# Altium schematic sheet RPI_CM5_PINOUT.SchDoc
size C; SheetNumber: 4; SheetTotal: 17
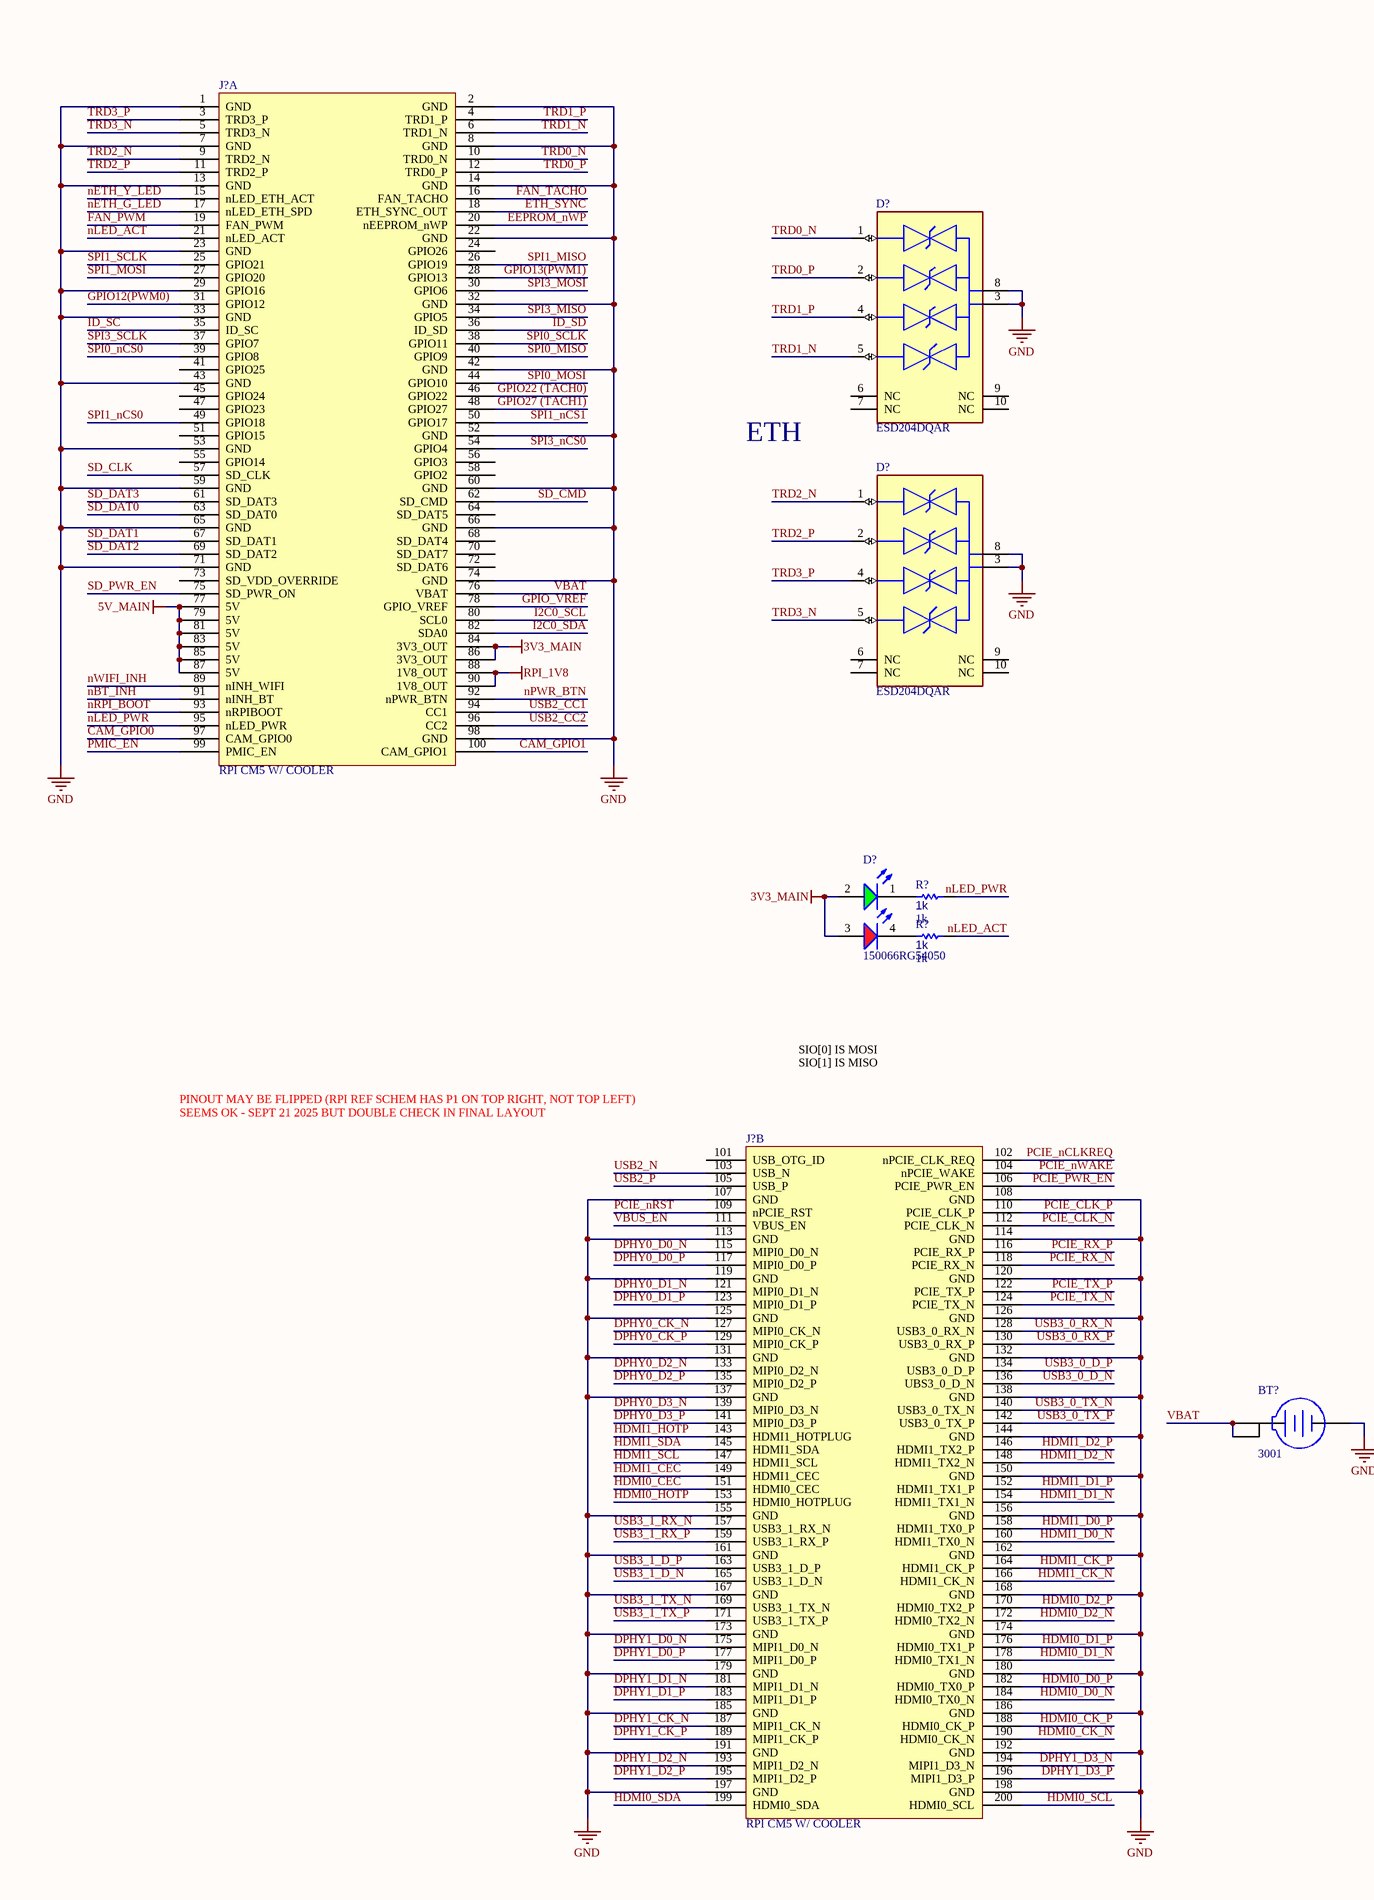
[diagram p0: RPI_CM5_PINOUT.SchDoc, left]
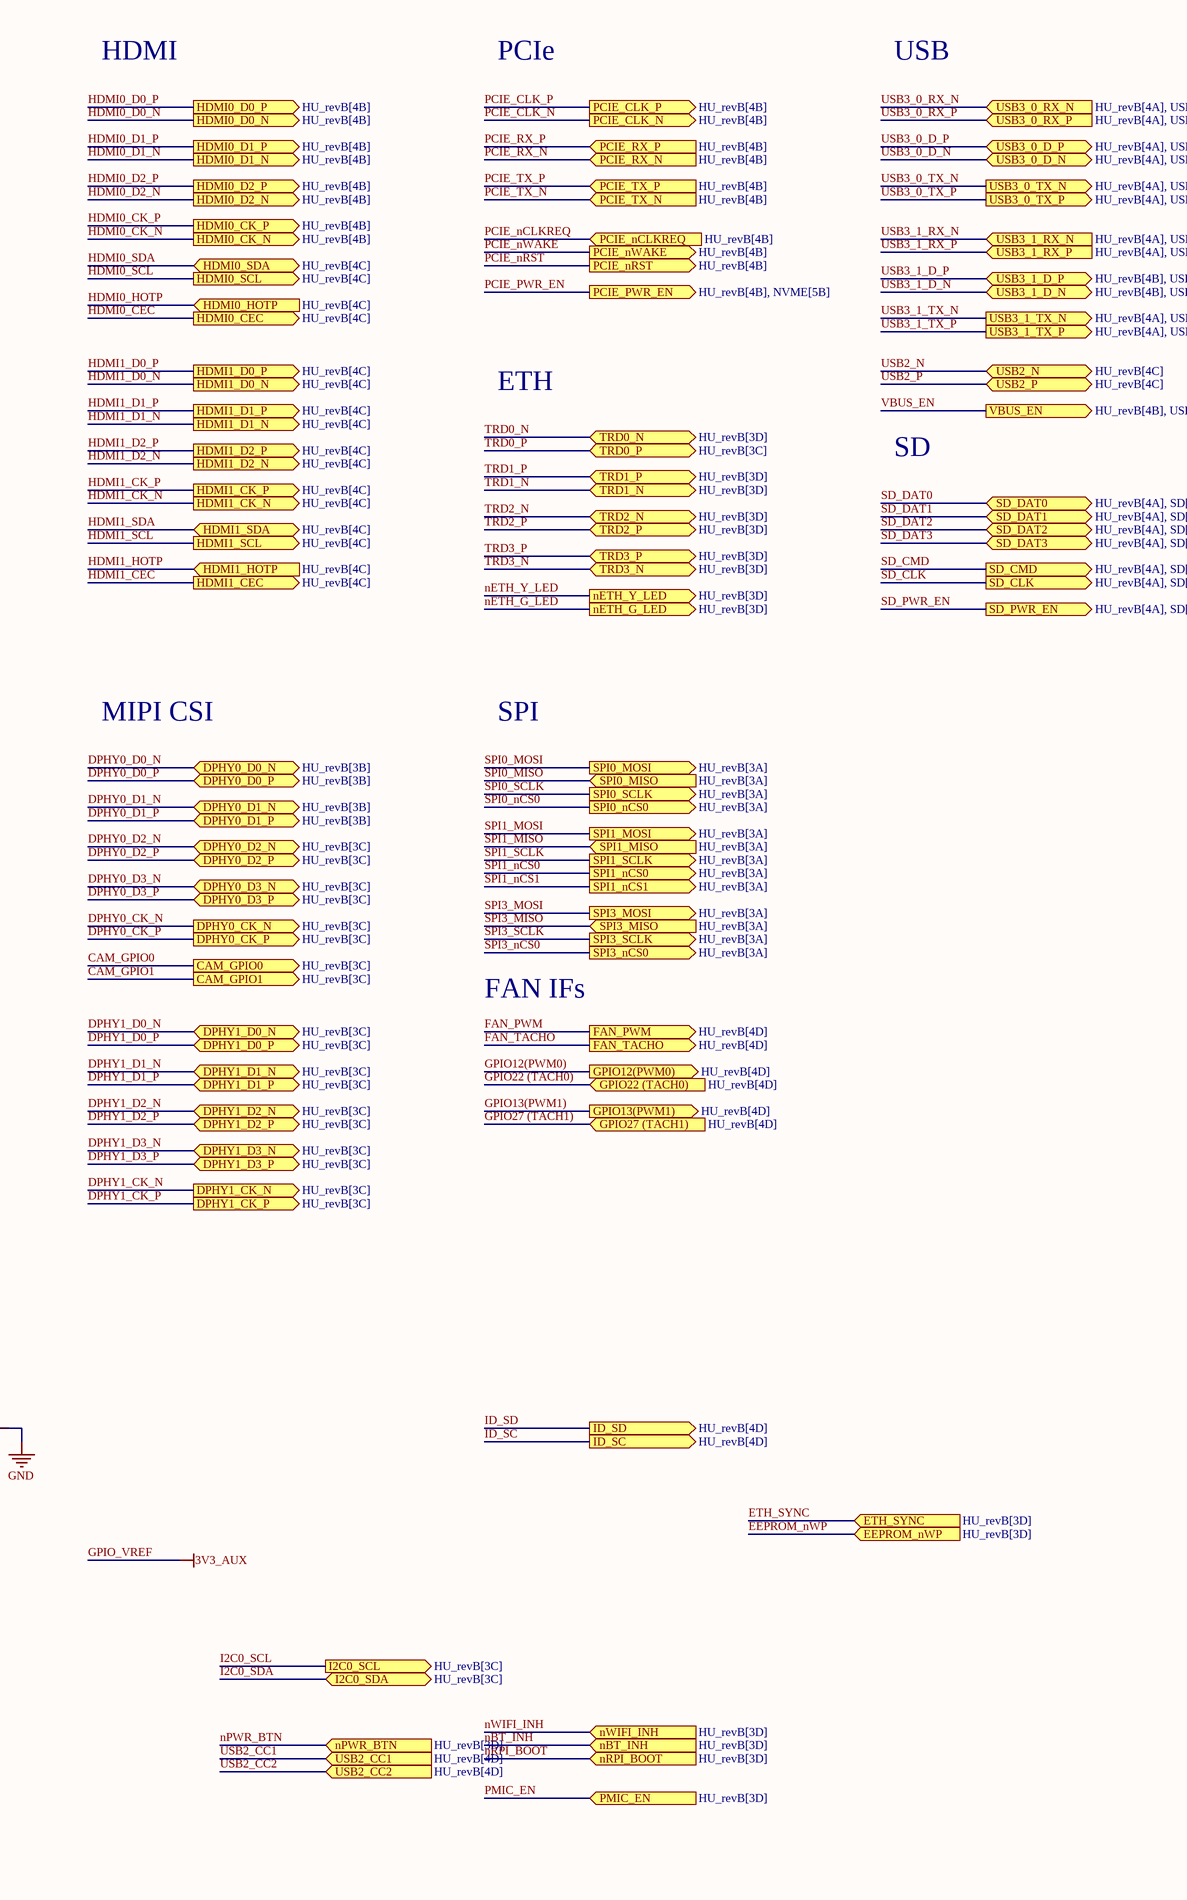
[diagram p1: RPI_CM5_PINOUT.SchDoc, right]

## Parts
(Parts that share a designator on the sheet are numbered #1, #2 ... from top to bottom, then left to right.)
BT?  3001  [KSTN-3001_V]
D?#1  ESD204DQAR  [FP-DQA0010A-MFG]
D?#2  ESD204DQAR  [FP-DQA0010A-MFG]
D?#3  150066RG54050  [WL-SBCD_0606]
J?#1  RPI CM5 W/ COOLER  [RPI CM5 W_ COOLER-Footprint-1]  (part A of 2)
J?#2  RPI CM5 W/ COOLER  [RPI CM5 W_ COOLER-Footprint-1]  (part B of 2)
R?#1  1k  [R0603B]
R?#2  1k  [R0603B]

## Ports
CAM_GPIO0 (out, see HU_revB[3C]), CAM_GPIO1 (out, see HU_revB[3C]), DPHY0_CK_N (out, see HU_revB[3C]), DPHY0_CK_P (out, see HU_revB[3C]), DPHY0_D0_N (bidir, see HU_revB[3B]), DPHY0_D0_P (bidir, see HU_revB[3B]), DPHY0_D1_N (bidir, see HU_revB[3B]), DPHY0_D1_P (bidir, see HU_revB[3B]), DPHY0_D2_N (bidir, see HU_revB[3C]), DPHY0_D2_P (bidir, see HU_revB[3C]), DPHY0_D3_N (bidir, see HU_revB[3C]), DPHY0_D3_P (bidir, see HU_revB[3C]), DPHY1_CK_N (out, see HU_revB[3C]), DPHY1_CK_P (out, see HU_revB[3C]), DPHY1_D0_N (bidir, see HU_revB[3C]), DPHY1_D0_P (bidir, see HU_revB[3C]), DPHY1_D1_N (bidir, see HU_revB[3C]), DPHY1_D1_P (bidir, see HU_revB[3C]), DPHY1_D2_N (bidir, see HU_revB[3C]), DPHY1_D2_P (bidir, see HU_revB[3C]), DPHY1_D3_N (bidir, see HU_revB[3C]), DPHY1_D3_P (bidir, see HU_revB[3C]), EEPROM_nWP (in, see HU_revB[3D]), ETH_SYNC (in, see HU_revB[3D]), FAN_PWM (out, see HU_revB[4D]), FAN_TACHO (out, see HU_revB[4D]), GPIO12(PWM0) (out, see HU_revB[4D]), GPIO13(PWM1) (out, see HU_revB[4D]), GPIO22 (TACH0) (in, see HU_revB[4D]), GPIO27 (TACH1) (in, see HU_revB[4D]), HDMI0_CEC (out, see HU_revB[4C]), HDMI0_CK_N (out, see HU_revB[4B]), HDMI0_CK_P (out, see HU_revB[4B]), HDMI0_D0_N (out, see HU_revB[4B]), HDMI0_D0_P (out, see HU_revB[4B]), HDMI0_D1_N (out, see HU_revB[4B]), HDMI0_D1_P (out, see HU_revB[4B]), HDMI0_D2_N (out, see HU_revB[4B]), HDMI0_D2_P (out, see HU_revB[4B]), HDMI0_HOTP (in, see HU_revB[4C]), HDMI0_SCL (out, see HU_revB[4C]), HDMI0_SDA (bidir, see HU_revB[4C]), HDMI1_CEC (out, see HU_revB[4C]), HDMI1_CK_N (out, see HU_revB[4C]), HDMI1_CK_P (out, see HU_revB[4C]), HDMI1_D0_N (out, see HU_revB[4C]), HDMI1_D0_P (out, see HU_revB[4C]), HDMI1_D1_N (out, see HU_revB[4C]), HDMI1_D1_P (out, see HU_revB[4C]), HDMI1_D2_N (out, see HU_revB[4C]), HDMI1_D2_P (out, see HU_revB[4C]), HDMI1_HOTP (in, see HU_revB[4C]), HDMI1_SCL (out, see HU_revB[4C]), HDMI1_SDA (bidir, see HU_revB[4C]), I2C0_SCL (out, see HU_revB[3C]), I2C0_SDA (bidir, see HU_revB[3C]), ID_SC (out, see HU_revB[4D]), ID_SD (out, see HU_revB[4D]), nBT_INH (in, see HU_revB[3D]), nETH_G_LED (out, see HU_revB[3D]), nETH_Y_LED (out, see HU_revB[3D]), nPWR_BTN (in, see HU_revB[3D]), nRPI_BOOT (in, see HU_revB[3D]), nWIFI_INH (in, see HU_revB[3D]), PCIE_CLK_N (out, see HU_revB[4B]), PCIE_CLK_P (out, see HU_revB[4B]), PCIE_nCLKREQ (in, see HU_revB[4B]), PCIE_nRST (out, see HU_revB[4B]), PCIE_nWAKE (out, see HU_revB[4B]), PCIE_PWR_EN (out, see HU_revB[4B], NVME[5B]), PCIE_RX_N (in, see HU_revB[4B]), PCIE_RX_P (in, see HU_revB[4B]), PCIE_TX_N (in, see HU_revB[4B]), PCIE_TX_P (in, see HU_revB[4B]), PMIC_EN (in, see HU_revB[3D]), SD_CLK (out, see HU_revB[4A], SD[3B]), SD_CMD (out, see HU_revB[4A], SD[3B]), SD_DAT0 (bidir, see HU_revB[4A], SD[3B]), SD_DAT1 (bidir, see HU_revB[4A], SD[3B]), SD_DAT2 (bidir, see HU_revB[4A], SD[3B]), SD_DAT3 (bidir, see HU_revB[4A], SD[3B]), SD_PWR_EN (out, see HU_revB[4A], SD[1B]), SPI0_MISO (in, see HU_revB[3A]), SPI0_MOSI (out, see HU_revB[3A]), SPI0_nCS0 (out, see HU_revB[3A]), SPI0_SCLK (out, see HU_revB[3A]), SPI1_MISO (in, see HU_revB[3A]), SPI1_MOSI (out, see HU_revB[3A]), SPI1_nCS0 (out, see HU_revB[3A]), SPI1_nCS1 (out, see HU_revB[3A]), SPI1_SCLK (out, see HU_revB[3A]), SPI3_MISO (in, see HU_revB[3A]), SPI3_MOSI (out, see HU_revB[3A]), SPI3_nCS0 (out, see HU_revB[3A]), SPI3_SCLK (out, see HU_revB[3A]), TRD0_N (bidir, see HU_revB[3D]), TRD0_P (bidir, see HU_revB[3C]), TRD1_N (bidir, see HU_revB[3D]), TRD1_P (bidir, see HU_revB[3D]), TRD2_N (bidir, see HU_revB[3D]), TRD2_P (bidir, see HU_revB[3D]), TRD3_N (bidir, see HU_revB[3D]), TRD3_P (bidir, see HU_revB[3D]), USB2_CC1 (in, see HU_revB[4D]), USB2_CC2 (in, see HU_revB[4D]), USB2_N (bidir, see HU_revB[4C]), USB2_P (bidir, see HU_revB[4C]), USB3_0_D_N (bidir, see HU_revB[4A], USB[3A]), USB3_0_D_P (bidir, see HU_revB[4A], USB[3A]), USB3_0_RX_N (in, see HU_revB[4A], USB[3B]), USB3_0_RX_P (in, see HU_revB[4A], USB[3B]), USB3_0_TX_N (out, see HU_revB[4A], USB[3B]), USB3_0_TX_P (out, see HU_revB[4A], USB[3B]), USB3_1_D_N (bidir, see HU_revB[4B], USB[3B]), USB3_1_D_P (bidir, see HU_revB[4B], USB[3C]), USB3_1_RX_N (in, see HU_revB[4A], USB[3C]), USB3_1_RX_P (in, see HU_revB[4A], USB[3C]), USB3_1_TX_N (out, see HU_revB[4A], USB[3C]), USB3_1_TX_P (out, see HU_revB[4A], USB[3C]), VBUS_EN (out, see HU_revB[4B], USB[1B])

## Nets
3V3_MAIN: D?#3.2(A) D?#3.3(A) J?#1.84(3V3_OUT) J?#1.86(3V3_OUT)
5V_MAIN: J?#1.77(5V) J?#1.79(5V) J?#1.81(5V) J?#1.83(5V) J?#1.85(5V) J?#1.87(5V)
GND: BT?.3(-) D?#1.3(GND) D?#1.8(GND) D?#2.3(GND) D?#2.8(GND) J?#1.1(GND) J?#1.2(GND) J?#1.7(GND) J?#1.8(GND) J?#1.13(GND) J?#1.14(GND) J?#1.22(GND) J?#1.23(GND) J?#1.29(GPIO16) J?#1.32(GND) J?#1.33(GND) J?#1.42(GND) J?#1.43(GND) J?#1.52(GND) J?#1.53(GND) J?#1.59(GND) J?#1.60(GND) J?#1.65(GND) J?#1.66(GND) J?#1.71(GND) J?#1.74(GND) J?#1.98(GND) J?#2.107(GND) J?#2.108(GND) J?#2.113(GND) J?#2.114(GND) J?#2.119(GND) J?#2.120(GND) J?#2.125(GND) J?#2.126(GND) J?#2.131(GND) J?#2.132(GND) J?#2.137(GND) J?#2.138(GND) J?#2.144(GND) J?#2.150(GND) J?#2.155(GND) J?#2.156(GND) J?#2.161(GND) J?#2.162(GND) J?#2.167(GND) J?#2.168(GND) J?#2.173(GND) J?#2.174(GND) J?#2.179(GND) J?#2.180(GND) J?#2.185(GND) J?#2.186(GND) J?#2.191(GND) J?#2.192(GND) J?#2.197(GND) J?#2.198(GND)
GPIO_VREF: J?#1.78(GPIO_VREF)  [also labelled 3V3_AUX]
RPI_1V8: J?#1.88(1V8_OUT) J?#1.90(1V8_OUT)
CAM_GPIO0: J?#1.97(CAM_GPIO0) ; port CAM_GPIO0
CAM_GPIO1: J?#1.100(CAM_GPIO1) ; port CAM_GPIO1
DPHY0_CK_N: J?#2.127(MIPI0_CK_N) ; port DPHY0_CK_N
DPHY0_CK_P: J?#2.129(MIPI0_CK_P) ; port DPHY0_CK_P
DPHY0_D0_N: J?#2.115(MIPI0_D0_N) ; port DPHY0_D0_N
DPHY0_D0_P: J?#2.117(MIPI0_D0_P) ; port DPHY0_D0_P
DPHY0_D1_N: J?#2.121(MIPI0_D1_N) ; port DPHY0_D1_N
DPHY0_D1_P: J?#2.123(MIPI0_D1_P) ; port DPHY0_D1_P
DPHY0_D2_N: J?#2.133(MIPI0_D2_N) ; port DPHY0_D2_N
DPHY0_D2_P: J?#2.135(MIPI0_D2_P) ; port DPHY0_D2_P
DPHY0_D3_N: J?#2.139(MIPI0_D3_N) ; port DPHY0_D3_N
DPHY0_D3_P: J?#2.141(MIPI0_D3_P) ; port DPHY0_D3_P
DPHY1_CK_N: J?#2.187(MIPI1_CK_N) ; port DPHY1_CK_N
DPHY1_CK_P: J?#2.189(MIPI1_CK_P) ; port DPHY1_CK_P
DPHY1_D0_N: J?#2.175(MIPI1_D0_N) ; port DPHY1_D0_N
DPHY1_D0_P: J?#2.177(MIPI1_D0_P) ; port DPHY1_D0_P
DPHY1_D1_N: J?#2.181(MIPI1_D1_N) ; port DPHY1_D1_N
DPHY1_D1_P: J?#2.183(MIPI1_D1_P) ; port DPHY1_D1_P
DPHY1_D2_N: J?#2.193(MIPI1_D2_N) ; port DPHY1_D2_N
DPHY1_D2_P: J?#2.195(MIPI1_D2_P) ; port DPHY1_D2_P
DPHY1_D3_N: J?#2.194(MIPI1_D3_N) ; port DPHY1_D3_N
DPHY1_D3_P: J?#2.196(MIPI1_D3_P) ; port DPHY1_D3_P
EEPROM_nWP: J?#1.20(nEEPROM_nWP) ; port EEPROM_nWP
ETH_SYNC: J?#1.18(ETH_SYNC_OUT) ; port ETH_SYNC
FAN_PWM: J?#1.19(FAN_PWM) ; port FAN_PWM
FAN_TACHO: J?#1.16(FAN_TACHO) ; port FAN_TACHO
GPIO12(PWM0): J?#1.31(GPIO12) ; port GPIO12(PWM0)
GPIO13(PWM1): J?#1.28(GPIO13) ; port GPIO13(PWM1)
GPIO22 (TACH0): J?#1.46(GPIO22) ; port GPIO22 (TACH0)
GPIO27 (TACH1): J?#1.48(GPIO27) ; port GPIO27 (TACH1)
HDMI0_CEC: J?#2.151(HDMI0_CEC) ; port HDMI0_CEC
HDMI0_CK_N: J?#2.190(HDMI0_CK_N) ; port HDMI0_CK_N
HDMI0_CK_P: J?#2.188(HDMI0_CK_P) ; port HDMI0_CK_P
HDMI0_D0_N: J?#2.184(HDMI0_TX0_N) ; port HDMI0_D0_N
HDMI0_D0_P: J?#2.182(HDMI0_TX0_P) ; port HDMI0_D0_P
HDMI0_D1_N: J?#2.178(HDMI0_TX1_N) ; port HDMI0_D1_N
HDMI0_D1_P: J?#2.176(HDMI0_TX1_P) ; port HDMI0_D1_P
HDMI0_D2_N: J?#2.172(HDMI0_TX2_N) ; port HDMI0_D2_N
HDMI0_D2_P: J?#2.170(HDMI0_TX2_P) ; port HDMI0_D2_P
HDMI0_HOTP: J?#2.153(HDMI0_HOTPLUG) ; port HDMI0_HOTP
HDMI0_SCL: J?#2.200(HDMI0_SCL) ; port HDMI0_SCL
HDMI0_SDA: J?#2.199(HDMI0_SDA) ; port HDMI0_SDA
HDMI1_CEC: J?#2.149(HDMI1_CEC) ; port HDMI1_CEC
HDMI1_CK_N: J?#2.166(HDMI1_CK_N) ; port HDMI1_CK_N
HDMI1_CK_P: J?#2.164(HDMI1_CK_P) ; port HDMI1_CK_P
HDMI1_D0_N: J?#2.160(HDMI1_TX0_N) ; port HDMI1_D0_N
HDMI1_D0_P: J?#2.158(HDMI1_TX0_P) ; port HDMI1_D0_P
HDMI1_D1_N: J?#2.154(HDMI1_TX1_N) ; port HDMI1_D1_N
HDMI1_D1_P: J?#2.152(HDMI1_TX1_P) ; port HDMI1_D1_P
HDMI1_D2_N: J?#2.148(HDMI1_TX2_N) ; port HDMI1_D2_N
HDMI1_D2_P: J?#2.146(HDMI1_TX2_P) ; port HDMI1_D2_P
HDMI1_HOTP: J?#2.143(HDMI1_HOTPLUG) ; port HDMI1_HOTP
HDMI1_SCL: J?#2.147(HDMI1_SCL) ; port HDMI1_SCL
HDMI1_SDA: J?#2.145(HDMI1_SDA) ; port HDMI1_SDA
I2C0_SCL: J?#1.80(SCL0) ; port I2C0_SCL
I2C0_SDA: J?#1.82(SDA0) ; port I2C0_SDA
ID_SC: J?#1.35(ID_SC) ; port ID_SC
ID_SD: J?#1.36(ID_SD) ; port ID_SD
nBT_INH: J?#1.91(nINH_BT) ; port nBT_INH
nETH_G_LED: J?#1.17(nLED_ETH_SPD) ; port nETH_G_LED
nETH_Y_LED: J?#1.15(nLED_ETH_ACT) ; port nETH_Y_LED
nLED_ACT: J?#1.21(nLED_ACT) R?#2.2
nLED_PWR: J?#1.95(nLED_PWR) R?#1.2
nPWR_BTN: J?#1.92(nPWR_BTN) ; port nPWR_BTN
nRPI_BOOT: J?#1.93(nRPIBOOT) ; port nRPI_BOOT
nWIFI_INH: J?#1.89(nINH_WIFI) ; port nWIFI_INH
PCIE_CLK_N: J?#2.112(PCIE_CLK_N) ; port PCIE_CLK_N
PCIE_CLK_P: J?#2.110(PCIE_CLK_P) ; port PCIE_CLK_P
PCIE_nCLKREQ: J?#2.102(nPCIE_CLK_REQ) ; port PCIE_nCLKREQ
PCIE_nRST: J?#2.109(nPCIE_RST) ; port PCIE_nRST
PCIE_nWAKE: J?#2.104(nPCIE_WAKE) ; port PCIE_nWAKE
PCIE_PWR_EN: J?#2.106(PCIE_PWR_EN) ; port PCIE_PWR_EN
PCIE_RX_N: J?#2.118(PCIE_RX_N) ; port PCIE_RX_N
PCIE_RX_P: J?#2.116(PCIE_RX_P) ; port PCIE_RX_P
PCIE_TX_N: J?#2.124(PCIE_TX_N) ; port PCIE_TX_N
PCIE_TX_P: J?#2.122(PCIE_TX_P) ; port PCIE_TX_P
PMIC_EN: J?#1.99(PMIC_EN) ; port PMIC_EN
SD_CLK: J?#1.57(SD_CLK) ; port SD_CLK
SD_CMD: J?#1.62(SD_CMD) ; port SD_CMD
SD_DAT0: J?#1.63(SD_DAT0) ; port SD_DAT0
SD_DAT1: J?#1.67(SD_DAT1) ; port SD_DAT1
SD_DAT2: J?#1.69(SD_DAT2) ; port SD_DAT2
SD_DAT3: J?#1.61(SD_DAT3) ; port SD_DAT3
SD_PWR_EN: J?#1.75(SD_PWR_ON) ; port SD_PWR_EN
SPI0_MISO: J?#1.40(GPIO9) ; port SPI0_MISO
SPI0_MOSI: J?#1.44(GPIO10) ; port SPI0_MOSI
SPI0_nCS0: J?#1.39(GPIO8) ; port SPI0_nCS0
SPI0_SCLK: J?#1.38(GPIO11) ; port SPI0_SCLK
SPI1_MISO: J?#1.26(GPIO19) ; port SPI1_MISO
SPI1_MOSI: J?#1.27(GPIO20) ; port SPI1_MOSI
SPI1_nCS0: J?#1.49(GPIO18) ; port SPI1_nCS0
SPI1_nCS1: J?#1.50(GPIO17) ; port SPI1_nCS1
SPI1_SCLK: J?#1.25(GPIO21) ; port SPI1_SCLK
SPI3_MISO: J?#1.34(GPIO5) ; port SPI3_MISO
SPI3_MOSI: J?#1.30(GPIO6) ; port SPI3_MOSI
SPI3_nCS0: J?#1.54(GPIO4) ; port SPI3_nCS0
SPI3_SCLK: J?#1.37(GPIO7) ; port SPI3_SCLK
TRD0_N: D?#1.1(IO1) J?#1.10(TRD0_N) ; port TRD0_N
TRD0_P: D?#1.2(IO2) J?#1.12(TRD0_P) ; port TRD0_P
TRD1_N: D?#1.5(IO4) J?#1.6(TRD1_N) ; port TRD1_N
TRD1_P: D?#1.4(IO3) J?#1.4(TRD1_P) ; port TRD1_P
TRD2_N: D?#2.1(IO1) J?#1.9(TRD2_N) ; port TRD2_N
TRD2_P: D?#2.2(IO2) J?#1.11(TRD2_P) ; port TRD2_P
TRD3_N: D?#2.5(IO4) J?#1.5(TRD3_N) ; port TRD3_N
TRD3_P: D?#2.4(IO3) J?#1.3(TRD3_P) ; port TRD3_P
USB2_CC1: J?#1.94(CC1) ; port USB2_CC1
USB2_CC2: J?#1.96(CC2) ; port USB2_CC2
USB2_N: J?#2.103(USB_N) ; port USB2_N
USB2_P: J?#2.105(USB_P) ; port USB2_P
USB3_0_D_N: J?#2.136(UBS3_0_D_N) ; port USB3_0_D_N
USB3_0_D_P: J?#2.134(USB3_0_D_P) ; port USB3_0_D_P
USB3_0_RX_N: J?#2.128(USB3_0_RX_N) ; port USB3_0_RX_N
USB3_0_RX_P: J?#2.130(USB3_0_RX_P) ; port USB3_0_RX_P
USB3_0_TX_N: J?#2.140(USB3_0_TX_N) ; port USB3_0_TX_N
USB3_0_TX_P: J?#2.142(USB3_0_TX_P) ; port USB3_0_TX_P
USB3_1_D_N: J?#2.165(USB3_1_D_N) ; port USB3_1_D_N
USB3_1_D_P: J?#2.163(USB3_1_D_P) ; port USB3_1_D_P
USB3_1_RX_N: J?#2.157(USB3_1_RX_N) ; port USB3_1_RX_N
USB3_1_RX_P: J?#2.159(USB3_1_RX_P) ; port USB3_1_RX_P
USB3_1_TX_N: J?#2.169(USB3_1_TX_N) ; port USB3_1_TX_N
USB3_1_TX_P: J?#2.171(USB3_1_TX_P) ; port USB3_1_TX_P
VBAT: BT?.1(+) BT?.2(+) J?#1.76(VBAT)
VBUS_EN: J?#2.111(VBUS_EN) ; port VBUS_EN
NetD?#3_1: D?#3.1(K) R?#1.1
NetD?#3_4: D?#3.4(K) R?#2.1

Not connected (* = marked no-connect by the designer): D?#1 6(NC) 7(NC) 9(NC) 10(NC); D?#2 6(NC) 7(NC) 9(NC) 10(NC); J?#1 24(GPIO26) 41(GPIO25) 45(GPIO24) 47(GPIO23) 51(GPIO15) 55(GPIO14) 56(GPIO3) 58(GPIO2) 64(SD_DAT5) 68(SD_DAT4) 70(SD_DAT7) 72(SD_DAT6) 73(SD_VDD_OVERRIDE); J?#2 101(USB_OTG_ID)

## Notes on the sheet
- HDMI
- PCIe
- USB
- ETH
- SD
- MIPI CSI
- SPI
- FAN IFs
- PINOUT MAY BE FLIPPED (RPI REF SCHEM HAS P1 ON TOP RIGHT, NOT TOP LEFT)
- SEEMS OK - SEPT 21 2025 BUT DOUBLE CHECK IN FINAL LAYOUT
- SIO[0] IS MOSI
  SIO[1] IS MISO

## Library data of the parts
BT? = CMP-2000-05463-1: Holder Battery Coin, 12 mm, 2-Pin THD, RoHS; Manufacturer: Keystone; Package Reference: 3001; Package Description: 2-Pin Through Hole Device, Body 13.21 x 12.07 mm; Datasheet Version: Rev. H, 09/2006; Datasheet URL: https://datasheet.ciiva.com/3/3001-3954.pdf; Mounting Technology: ThroughHole; Manufacturer URL: http://www.keyelco.com/
D?#1 D?#2 = CMP-04989-000002-1: 4-CHANNEL LOW-CAPACITANCE SURGE; Manufacturer: Texas Instruments; Value: 0.55pF; Reverse Standoff Voltage: 3.6V; Standoff Height: 0mm; Breakdown Voltage: 5.5V; Peak Pulse Current: 5.5A; Clamping Voltage: 11.5V; Direction: Bidirectional; Peak Pulse Power: 50W; Number Of Channels: 4; Ambient Temperature Range High: +125°C; ComponentLink2Description: Datasheet; Height: 0.55mm; Lead Free: Yes; Device Class L3: unset; Temperature Range High: +125°C; Temperature Range Low: -40°C; Package: DQA0010A; Temperature: -40°C to +125°C; Capacitance: 0.55pF; RoHS: TRUE; Mouser Description: 4-Channel Low-Capacitance Surge and ESD Protection Diode 10-USON -40 to 125; Category: Diode; Device Class L1: Circuit Protection; Octopart: https://octopart.com/esd204dqar-texas+instruments-89917476; Device Class L2: TVS Diodes; Ambient Temperature Range Low: -40°C; Manufacturer Part Number: ESD204DQAR; ComponentLink2URL: http://www.ti.com/lit/ds/symlink/esd204.pdf; Automotive: No; Digikey Description: 4-CHANNEL LOW-CAPACITANCE SURGE
D?#3 = CMP-004-00040-2: Led, Red/Grn, 180Mcd/230Mcd, 624Nm/525Nm Rohs Compliant: Yes; Source: rgled.SchLib; Component Type: Standard; Pins: 4; Design Item ID: CMP-004-00034-2
J?#1 J?#2 = CMP-00028-00005-3: Mechanical placeholder for RPI CM5 w/ active cooler on it
R?#1 R?#2 = CMP-009-00002-14: Resistor; Value: 1k